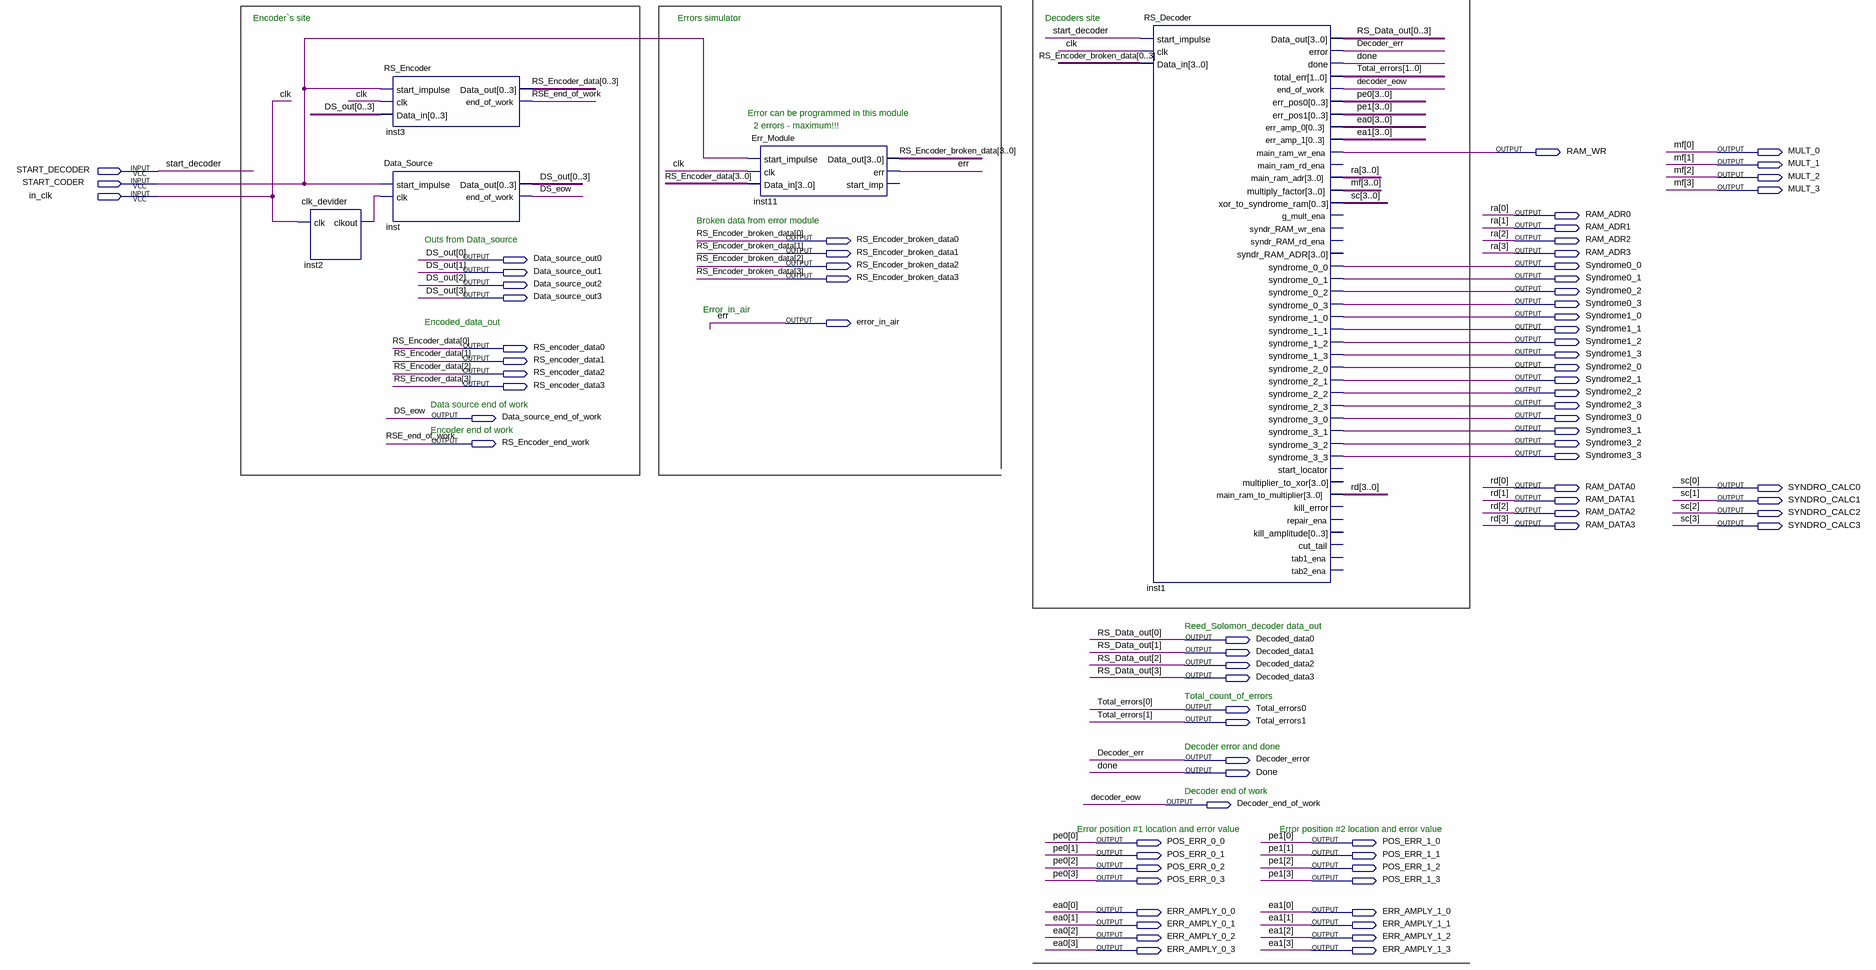
[diagram p0: schematic sheet]
// Quartus schematic schema.bdf as structural Verilog: 5 symbols, 76 pins
module schema (
  input  START_DECODER,
  input  START_CODER,
  input  in_clk,
  output RAM_WR,
  output MULT_0,
  output MULT_1,
  output MULT_2,
  output MULT_3,
  output RAM_ADR0,
  output RAM_ADR1,
  output RS_Encoder_broken_data0,
  output RAM_ADR2,
  output RS_Encoder_broken_data1,
  output RAM_ADR3,
  output Data_source_out0,
  output RS_Encoder_broken_data2,
  output Syndrome0_0,
  output Data_source_out1,
  output RS_Encoder_broken_data3,
  output Syndrome0_1,
  output Data_source_out2,
  output Syndrome0_2,
  output Data_source_out3,
  output Syndrome0_3,
  output Syndrome1_0,
  output error_in_air,
  output Syndrome1_1,
  output Syndrome1_2,
  output RS_encoder_data0,
  output Syndrome1_3,
  output RS_encoder_data1,
  output Syndrome2_0,
  output RS_encoder_data2,
  output Syndrome2_1,
  output RS_encoder_data3,
  output Syndrome2_2,
  output Syndrome2_3,
  output Data_source_end_of_work,
  output Syndrome3_0,
  output Syndrome3_1,
  output RS_Encoder_end_work,
  output Syndrome3_2,
  output Syndrome3_3,
  output RAM_DATA0,
  output SYNDRO_CALC0,
  output RAM_DATA1,
  output SYNDRO_CALC1,
  output RAM_DATA2,
  output SYNDRO_CALC2,
  output RAM_DATA3,
  output SYNDRO_CALC3,
  output Decoded_data0,
  output Decoded_data1,
  output Decoded_data2,
  output Decoded_data3,
  output Total_errors0,
  output Total_errors1,
  output Decoder_error,
  output Done,
  output Decoder_end_of_work,
  output POS_ERR_0_0,
  output POS_ERR_1_0,
  output POS_ERR_0_1,
  output POS_ERR_1_1,
  output POS_ERR_0_2,
  output POS_ERR_1_2,
  output POS_ERR_0_3,
  output POS_ERR_1_3,
  output ERR_AMPLY_0_0,
  output ERR_AMPLY_1_0,
  output ERR_AMPLY_0_1,
  output ERR_AMPLY_1_1,
  output ERR_AMPLY_0_2,
  output ERR_AMPLY_1_2,
  output ERR_AMPLY_0_3,
  output ERR_AMPLY_1_3
);

  wire inst2_clkout;

  clk_devider inst2 (.clk(in_clk), .clkout(inst2_clkout));
  RS_Encoder inst3 (
    .start_impulse(START_CODER), .clk(in_clk),
    .Data_in({Data_source_out0, Data_source_out1, Data_source_out2, Data_source_out3}),
    .Data_out({RS_encoder_data0, RS_encoder_data1, RS_encoder_data2, RS_encoder_data3}),
    .end_of_work(RS_Encoder_end_work));
  Data_Source inst (
    .start_impulse(START_CODER), .clk(inst2_clkout),
    .Data_out({Data_source_out0, Data_source_out1, Data_source_out2, Data_source_out3}),
    .end_of_work(Data_source_end_of_work));
  Err_Module inst11 (
    .start_impulse(START_CODER), .clk(in_clk),
    .Data_in({RS_encoder_data3, RS_encoder_data2, RS_encoder_data1, RS_encoder_data0}),
    .Data_out({RS_Encoder_broken_data3, RS_Encoder_broken_data2, RS_Encoder_broken_data1, RS_Encoder_broken_data0}),
    .err(error_in_air));  // open: start_imp
  RS_Decoder inst1 (
    .start_impulse(START_DECODER), .clk(in_clk),
    .Data_in({RS_Encoder_broken_data0, RS_Encoder_broken_data1, RS_Encoder_broken_data2, RS_Encoder_broken_data3}),
    .Data_out({Decoded_data0, Decoded_data1, Decoded_data2, Decoded_data3}), .error(Decoder_error),
    .done(Done), .total_err({Total_errors1, Total_errors0}), .end_of_work(Decoder_end_of_work),
    .err_pos0({POS_ERR_0_3, POS_ERR_0_2, POS_ERR_0_1, POS_ERR_0_0}),
    .err_pos1({POS_ERR_1_3, POS_ERR_1_2, POS_ERR_1_1, POS_ERR_1_0}),
    .err_amp_0({ERR_AMPLY_0_3, ERR_AMPLY_0_2, ERR_AMPLY_0_1, ERR_AMPLY_0_0}),
    .err_amp_1({ERR_AMPLY_1_3, ERR_AMPLY_1_2, ERR_AMPLY_1_1, ERR_AMPLY_1_0}), .main_ram_wr_ena(RAM_WR),
    .main_ram_adr({RAM_ADR3, RAM_ADR2, RAM_ADR1, RAM_ADR0}),
    .multiply_factor({MULT_3, MULT_2, MULT_1, MULT_0}),
    .xor_to_syndrome_ram({SYNDRO_CALC3, SYNDRO_CALC2, SYNDRO_CALC1, SYNDRO_CALC0}),
    .syndrome_0_0(Syndrome0_0), .syndrome_0_1(Syndrome0_1), .syndrome_0_2(Syndrome0_2),
    .syndrome_0_3(Syndrome0_3), .syndrome_1_0(Syndrome1_0), .syndrome_1_1(Syndrome1_1),
    .syndrome_1_2(Syndrome1_2), .syndrome_1_3(Syndrome1_3), .syndrome_2_0(Syndrome2_0),
    .syndrome_2_1(Syndrome2_1), .syndrome_2_2(Syndrome2_2), .syndrome_2_3(Syndrome2_3),
    .syndrome_3_0(Syndrome3_0), .syndrome_3_1(Syndrome3_1), .syndrome_3_2(Syndrome3_2),
    .syndrome_3_3(Syndrome3_3), .main_ram_to_multiplier({RAM_DATA3, RAM_DATA2, RAM_DATA1, RAM_DATA0}));  // open: main_ram_rd_ena, g_mult_ena, syndr_RAM_wr_ena, syndr_RAM_rd_ena, syndr_RAM_ADR, start_locator, multiplier_to_xor, kill_error, repair_ena, kill_amplitude, cut_tail, tab1_ena, tab2_ena

  // Other names for the same wires on the sheet: clk = in_clk; decoder_eow = Decoder_end_of_work;
  //   Decoder_err = Decoder_error; DS_eow = Data_source_end_of_work;
  //   DS_out[3:0] = {Data_source_out3, Data_source_out2, Data_source_out1, Data_source_out0};
  //   ea0[3:0] = {ERR_AMPLY_0_3, ERR_AMPLY_0_2, ERR_AMPLY_0_1, ERR_AMPLY_0_0};
  //   ea1[3:0] = {ERR_AMPLY_1_3, ERR_AMPLY_1_2, ERR_AMPLY_1_1, ERR_AMPLY_1_0}; err = error_in_air;
  //   mf[3:0] = {MULT_3, MULT_2, MULT_1, MULT_0}; pe0[3:0] = {POS_ERR_0_3, POS_ERR_0_2, POS_ERR_0_1, POS_ERR_0_0};
  //   pe1[3:0] = {POS_ERR_1_3, POS_ERR_1_2, POS_ERR_1_1, POS_ERR_1_0};
  //   ra[3:0] = {RAM_ADR3, RAM_ADR2, RAM_ADR1, RAM_ADR0}; rd[3:0] = {RAM_DATA3, RAM_DATA2, RAM_DATA1, RAM_DATA0};
  //   RS_Data_out[3:0] = {Decoded_data3, Decoded_data2, Decoded_data1, Decoded_data0};
  //   RSE_end_of_work = RS_Encoder_end_work; sc[3:0] = {SYNDRO_CALC3, SYNDRO_CALC2, SYNDRO_CALC1, SYNDRO_CALC0}

  // Notes on the sheet:
  //   Encoder`s site
  //   Errors simulator
  //   Decoders site
  //   Error can be programmed in this module
  //   2 errors - maximum!!!
  //   Broken data from error module
  //   Outs from Data_source
  //   Error_in_air
  //   Encoded_data_out
  //   Data source end of work
  //   Encoder end of work
  //   Reed_Solomon_decoder data_out
  //   Total_count_of_errors
  //   Decoder error and done
  //   Decoder end of work
  //   Error position #1 location and error value
  //   Error position #2 location and error value
endmodule
